# Altium schematic sheet POWER.SchDoc
size A4; SheetNumber: 6; SheetTotal: 6
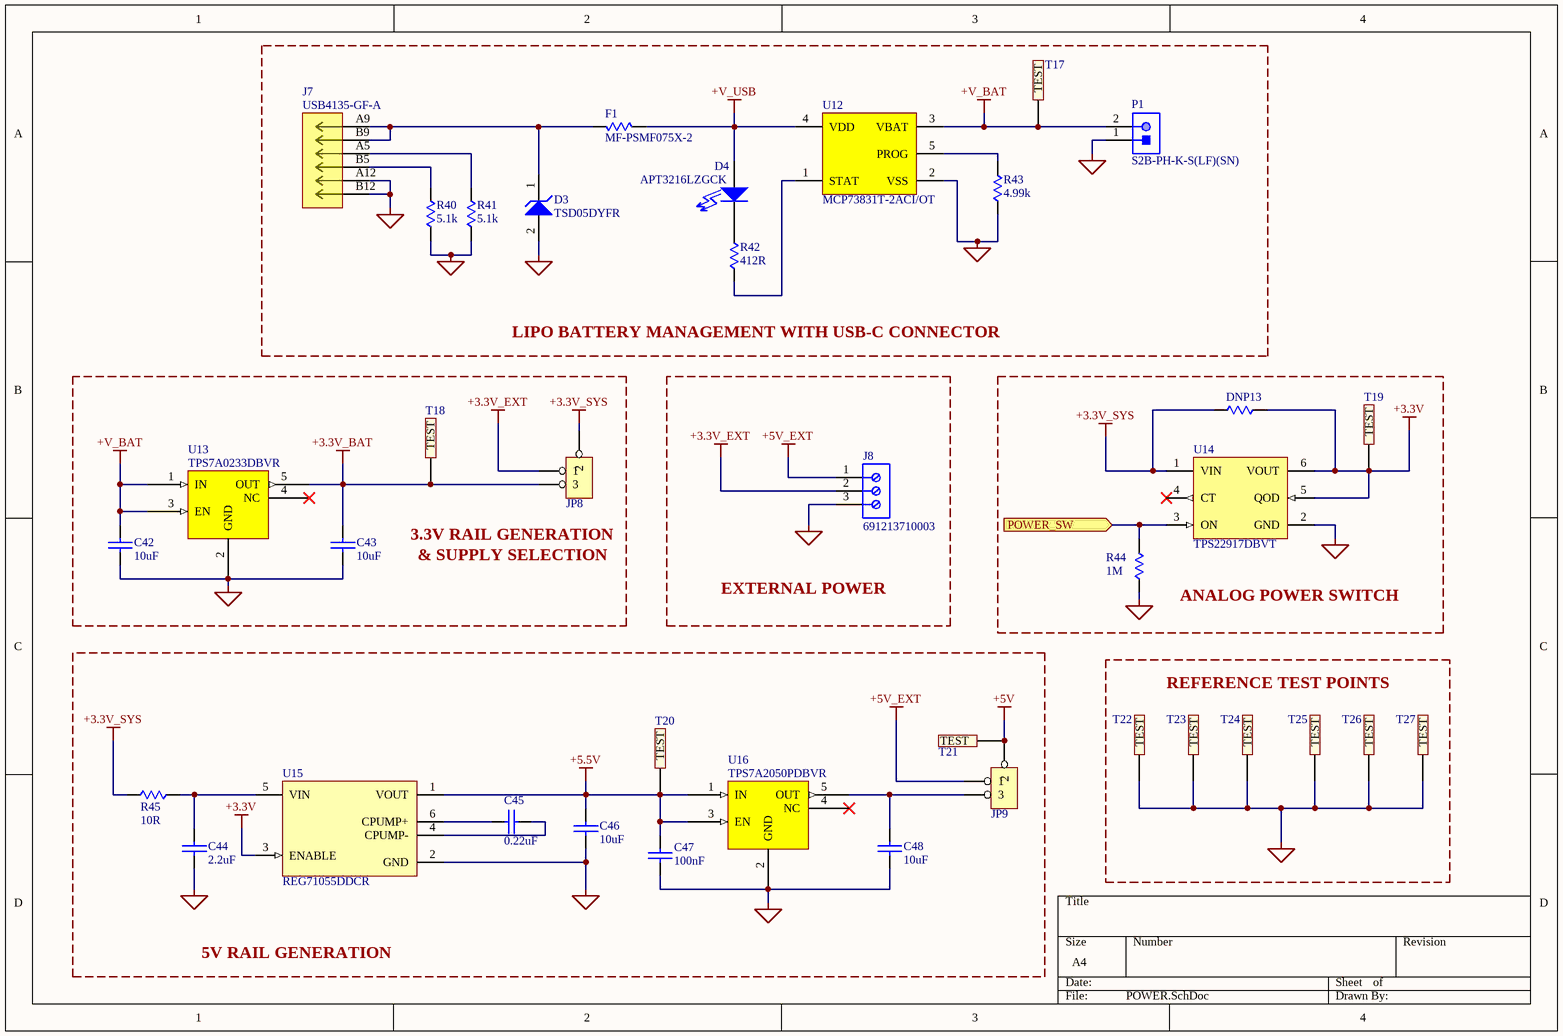
[diagram p0: POWER.SchDoc]

## Parts
C42  10uF  [0603-CAP]
C43  10uF  [0603-CAP]
C44  2.2uF  [0603-CAP]
C45  0.22uF  [0603-CAP]
C46  10uF  [0603-CAP]
C47  100nF  [0603-CAP]
C48  10uF  [0603-CAP]
D3  TSD05DYFR  [TVS_SOD2_DYF_TEX-L]
D4  APT3216LZGCK  [1206-LED]
DNP13  DNP  [0603-RES]  (value not drawn)  (no BOM)
F1  MF-PSMF075X-2  [0805-RES]
J7  USB4135-GF-A  [CONN_USB4135-GF-A_GCT]
J8  691213710003  [691213710003]
JP8  JUMPER1X3  [JUMPER3]  (value not drawn)
JP9  JUMPER1X3  [JUMPER3]  (value not drawn)
P1  S2B-PH-K-S(LF)(SN)  [JST-S2B-PH-K-S_V]
R40  5.1k  [0603-RES]
R41  5.1k  [0603-RES]
R42  412R  [0603-RES]
R43  4.99k  [0603-RES]
R44  1M  [0603-RES]
R45  10R  [0603-RES]
T17  5002K  [TESTPOINT White]  (value not drawn)
T18  5002K  [TESTPOINT White]  (value not drawn)
T19  5002K  [TESTPOINT White]  (value not drawn)
T20  5002K  [TESTPOINT White]  (value not drawn)
T21  5002K  [TESTPOINT White]  (value not drawn)
T22  5011K  [TESTPOINT Black]  (value not drawn)
T23  5011K  [TESTPOINT Black]  (value not drawn)
T24  5011K  [TESTPOINT Black]  (value not drawn)
T25  5011K  [TESTPOINT Black]  (value not drawn)
T26  5011K  [TESTPOINT Black]  (value not drawn)
T27  5011K  [TESTPOINT Black]  (value not drawn)
U12  MCP73831T-2ACI/OT  [SOT23_DBV_TEX-M]
U13  TPS7A0233DBVR  [SOT23_DBV_TEX-M]
U14  TPS22917DBVT  [DBV0006_N]
U15  REG71055DDCR  [DDC0006A_M]
U16  TPS7A2050PDBVR  [SOT23_DBV_TEX-M]

## Blocks framed on the sheet
LIPO BATTERY MANAGEMENT WITH USB-C CONNECTOR: D3 D4 F1 J7 P1 R40-R43 T17 U12
EXTERNAL POWER: J8
ANALOG POWER SWITCH: DNP13 R44 T19 U14
5V RAIL GENERATION: C44-C48 JP9 R45 T20 T21 U15 U16
REFERENCE TEST POINTS: T22-T27

## Ports
POWER_SW (in, see BLOCK DIAGRAM[2B], MCU[1A])

## Nets
+3.3V: DNP13.2 T19.1(TEST) U14.5(QOD) U14.6(VOUT) U15.3(ENABLE)
+3.3V_BAT: C43.1 JP8.3 T18.1(TEST) U13.5(OUT)
+3.3V_EXT: J8.2 JP8.1
+3.3V_SYS: DNP13.1 JP8.2 R45.1 U14.1(VIN)
+5.5V: C46.1 C47.1 T20.1(TEST) U15.1(VOUT) U16.1(IN) U16.3(EN)
+5V: JP9.2 T21.1(TEST)
+5V_EXT: J8.1 JP9.1
+V_BAT: C42.1 P1.2 T17.1(TEST) U12.3(VBAT) U13.1(IN) U13.3(EN)
+V_USB: D4.1 F1.2 U12.4(VDD)
GND: C42.2 C43.2 C44.1 C46.2 C47.2 C48.2 D3.2(A) J7.A12(GND) J7.B12(GND) J8.3 P1.1 R40.2 R41.2 R43.1 R44.1 T22.1(TEST) T23.1(TEST) T24.1(TEST) T25.1(TEST) T26.1(TEST) T27.1(TEST) U12.2(VSS) U13.2(GND) U14.2(GND) U15.2(GND) U16.2(GND)
POWER_SW: R44.2 U14.3(ON) ; port POWER_SW
NetC44_2: C44.2 R45.2 U15.5(VIN)
NetC45_1: C45.1 U15.6(CPUMP+)
NetC45_2: C45.2 U15.4(CPUMP-)
NetC48_1: C48.1 JP9.3 U16.5(OUT)
NetD3_1: D3.1(K) F1.1 J7.A9(VBUS) J7.B9(VBUS)
NetD4_2: D4.2 R42.2
NetJ7_A5: J7.A5(CC1) R41.1
NetJ7_B5: J7.B5(CC2) R40.1
NetR42_1: R42.1 U12.1(STAT)
NetR43_2: R43.2 U12.5(PROG)

Not connected (* = marked no-connect by the designer): U13 4(NC)*; U14 4(CT)*; U16 4(NC)*

## Notes on the sheet
- (near JP8) 3.3V RAIL GENERATION
- & SUPPLY SELECTION

## Library data of the parts
C42 C43 C46 C48 = CGA3E2C0G1H472J080AA: CAP CER 10uF 6.3V X5R 0603; Manufacturer Part Number 1: GRM188R60J106KE47D; Manufacturer 1: Murata Electronics; Detailed Description: CAP CER 100 NF 50V X7R 0603; Tech#: SMT; Supplier 1: DigiKey; Supplier Part Number 1: 490-12538-1-ND; Supplier 2: Mouser; Supplier Part Number 2: 810-CGA3E2C0G1H472J; Price(100): 0.1434; Price(250): 0.10756
C44 = CGA3E2C0G1H472J080AA: CAP CER 2.2UF 35V X5R 0603; Manufacturer Part Number 1: GRM188R6YA225MA12D; Manufacturer 1: Murata Electronics; Tech#: SMT; Detailed Description: CAP CER 2.2UF 35V X5R 0603; Supplier 1: DigiKey; Supplier Part Number 1: 490-10486-1-ND; Supplier 2: Mouser; Supplier Part Number 2: 810-CGA3E2C0G1H472J; Price(100): 0.1434; Price(250): 0.10756
C45 = CGA3E2C0G1H472J080AA: CAP CER 0.22UF 25V X7R 0603; Manufacturer Part Number 1: GRM188R71E224KA88D; Manufacturer 1: Murata Electronics; Tech#: SMT; Detailed Description: CAP CER 0.22UF 25V X7R 0603; Supplier 1: DigiKey; Supplier Part Number 1: 490-3290-1-ND; Supplier 2: Mouser; Supplier Part Number 2: 810-CGA3E2C0G1H472J; Price(100): 0.1434; Price(250): 0.10756
C47 = CGA3E2C0G1H472J080AA: CAP CER 100 NF 50V X7R 0603; Manufacturer Part Number 1: CC0603KRX7R9BB104; Manufacturer 1: YAGEO; Tech#: SMT; Detailed Description: CAP CER 100 NF 50V X7R 0603; Supplier 1: DigiKey; Supplier Part Number 1: 311-1344-1-ND; Supplier 2: Mouser; Supplier Part Number 2: 810-CGA3E2C0G1H472J; Price(100): 0.1434; Price(250): 0.10756
D3 = TSD05DYFR: 5-V 60-A Unidirectional surge protection device 2-SOT -40 to 125; Manufacturer_Name: Texas Instruments; Copyright: Copyright (C) 2026 Ultra Librarian. All rights reserved.; Manufacturer_Part_Number: TSD05DYFR; RefDes: RefDes; Type: Type
D4 = APT3216LZGCK: LED GREEN CLEAR 2SMD; Manufacturer 1: Kingbright; Detailed Description: LED, Green SMT1206 2.65V 2mA 50mcd; Location: #N/A; Tech#: SMT; Spec: 2.65V 2mA 50mcd; Manufacturer Part Number 1: APT3216LZGCK; Supplier 1: DigiKey; Supplier Part Number 1: 754-1944-1-ND; Supplier 2: Mouser; Supplier Part Number 2: 604-APT3216LZGCK; Price(1): 0.94; Price(10): 0.725; Price(25): 0.6076; Price(100): 0.5233; Colour: Green
DNP13 R40 R41 = 4.99K 0603: RES SMD 5.1K OHM 0.1% 1/10W 0603; Manufacturer Part Number 1: RG1608P-512-B-T5; Manufacturer 1: Susumu; Tech#: SMT; Detailed Description: RES SMD 5.1K OHM 0.1% 1/10W 0603; Supplier 1: DigiKey; Supplier Part Number 1: RG16P5.1KBCT-ND; Supplier 2: Mouser; Supplier Part Number 2: 754-RR0816P-4991D68H; Price(100): 0.023
F1 = 240R 0.1%: PTC RESET FUSE 6V 750MA 0805; Manufacturer 1: Bourns; Tech#: SMT; Manufacturer Part Number 1: MF-PSMF075X-2; Detailed Description: PTC RESET FUSE 6V 750MA 0805; Supplier 1: Digikey; Supplier Part Number 1: MF-PSMF075X-2CT-ND; Supplier 2: DigiKey; Supplier Part Number 2: RG20P240BCT-ND; Price(100): 0.149
J7 = USB4135-GF-A: Description; Manufacturer_Name: Global Connector Technology; Copyright: Copyright (C) 2026 Ultra Librarian. All rights reserved.; Manufacturer_Part_Number: USB4135-GF-A; RefDes: RefDes; Type: Type
J8 = CMP-1502-02527-3: 213 Series 5MM Pitch Straight, Pcb Terminal Block, Through Hole, 3 Way; Stripping Length: -7mm; Wire Gauge (Max): 26AWG; Pitch: 5.0038mm; Voltage: 300V; Current: 10A; Wire/Cable Gauge: 16AWG; Connector Type: PCB, Terminal Block; Plating: Brass, Steel; Number of Positions Per Level: 3; Number of Levels: 1; Height: 10mm; Housing Material: Nylon; Termination: Screw; RoHS: Compliant; Max Operating Temperature: 105°C; Contact Plating: Tin; Contact Material: Brass; Number of Pins: 3; Color: Green; Length: 8.3mm; REACH SVHC: Unknown; Packaging: Box; Wire Gauge (Min): 16AWG; Min Operating Temperature: -40°C; Lead Pitch: 5mm; Number of Contacts: 3; Width: 15.6mm; Mount: Through Hole
JP8 JP9 = 68001-203HLF: CONN HEADER VERT 36POS 2.54MM; Manufacturer 1: FCI; Detailed Description: Jumper, 1x3 Vertical T/H 0.1in; Location: #N/A; Notes: Can be 68001-236HLF cut to length; Tech#: T/H; Manufacturer Part Number 1: 68001-203HLF; Supplier 1: DigiKey; Supplier Part Number 1: 609-3470-ND; Supplier 2: Mouser; Supplier Part Number 2: 649-68001-203HLF; Price(1): 0.43; Price(10): 0.32; Price(25): 0.32; Price(100): 0.2436
P1 = CMP-1755-00004-1: Male Header, Pitch 2 mm, 1 x 2 Position, Height 4.8 mm, Tail Length 3.4 mm, -25 to 85 degC, RoHS, Bulk; Case\Package: Radial; Tolerance: 20%; Capacitance: 10 uF; Voltage Rating (DC): 50 V; Packaging: Bulk; ComponentLink1URL: http://www.jst-mfg.com/product/pdf/eng/ePH.pdf; Radiation Hardening: No; Height: 11 mm; Package Quantity: 200; PackageDescription: Male Header, Pitch 2 mm, 1 x 2 Position, Height 4.8 mm, Tail Length 3.4 mm; PackageReference: S2B-PH-K-S; Diameter: 5 mm; Pins: 2; Mount: Through Hole; Max Operating Temperature: 85 degC; Min Operating Temperature: -40 degC; ComponentLink1Description: Datasheet; DatasheetVersion: Dec-12; Length: 11 mm; Lead Pitch: 2 mm; REACH SVHC: No SVHC; Voltage Rating: 50 V; RoHSCompliant: true
R42 = 4.99K 0603: RES SMD 412OHM 0.1% 1/10W 0603; Manufacturer Part Number 1: RT0603BRD07412RL; Manufacturer 1: YAGEO; Tech#: SMT; Detailed Description: RES SMD 412OHM 0.1% 1/10W 0603; Supplier 1: DigiKey; Supplier Part Number 1: YAG1659CT-ND; Supplier 2: Mouser; Supplier Part Number 2: 754-RR0816P-4991D68H; Price(100): 0.023
R43 = 4.99K 0603: RES SMD 4.99KOHM 0.1% 1/10W 0603; Manufacturer Part Number 1: RG1608P-4991-B-T5; Manufacturer 1: Susumu; Tech#: SMT; Detailed Description: RES SMD 4.99KOHM 0.1% 1/10W 0603; Supplier 1: DigiKey; Supplier Part Number 1: RG16P4.99KBCT-ND; Supplier 2: Mouser; Supplier Part Number 2: 754-RR0816P-4991D68H; Price(100): 0.023
R44 = 4.99K 0603: RES SMD 1MOHM 0.1% 1/10W 0603; Manufacturer Part Number 1: RT0603BRD071ML; Manufacturer 1: YAGEO; Detailed Description: RES SMD 1OHM 0.1% 1/10W 0603; Tech#: SMT; Supplier 1: DigiKey; Supplier Part Number 1: YAG4498CT-ND; Supplier 2: Mouser; Supplier Part Number 2: 754-RR0816P-4991D68H; Price(100): 0.023
R45 = 4.99K 0603: RES SMD 10OHM 0.05% 1/10W 0603; Manufacturer Part Number 1: RNCF0603AKT10R0; Manufacturer 1: Stackpole Electronics; Tech#: SMT; Detailed Description: RES SMD 10OHM 0.05% 1/10W 0603; Supplier 1: DigiKey; Supplier Part Number 1: RNCF0603AKT10R0CT-ND; Supplier 2: Mouser; Supplier Part Number 2: 754-RR0816P-4991D68H; Price(100): 0.023
T17-T21 = 5002K: PC TEST POINT MINIATURE WHITE; Manufacturer 1: Keystone Electronics; Detailed Description: Connector, TestPoint White; Location: F1-33; Tech#: T/H; Manufacturer Part Number 1: 5002K; Supplier 1: DigiKey; Supplier Part Number 1: 36-5002-ND; Supplier 2: Mouser; Supplier Part Number 2: 534-5002; Price(1): 0.56; Price(10): 0.506; Price(100): 0.3541
T22-T27 = 5011K: PC TEST POINT MULTIPURPOSE BLACK; Manufacturer 1: Keystone Electronics; Detailed Description: Connector, TestPoint Black; Location: F1-34; Tech#: T/H; Manufacturer Part Number 1: 5011K; Supplier 1: DigiKey; Supplier Part Number 1: 36-5011-ND; Supplier 2: Mouser; Supplier Part Number 2: 534-5011; Price(1): 0.57; Price(10): 0.506; Price(100): 0.3541
U12 = CMP-0133-00143-2: IC CONTROLLR LI-ION 4.2V SOT23-5; Max Power Dissipation: 1.54W; Output Current: 500mA; Max Output Voltage: 4.5V; Number of Outputs: 1; Min Output Voltage: 4.168V; Min Supply Voltage: 3.75V; Max Input Voltage: 6V; Voltage Rating: 4.534V; Drain to Source Resistance: 350mR; Max Operating Temperature: 85°C; Length: 0.122inch; Number of Pins: 5; REACH SVHC: No SVHC; Radiation Hardening: No; Min Operating Temperature: -40°C; Weight: 0.00709oz; Contact Plating: Tin; Termination: SMD/SMT; Case/Package: SOT-23; Mount: Surface Mount; Width: 0.071inch; Packaging: Tape and Reel; Number of Cells: 1; Max Charge Current: 500mA; Height: 0.051inch; Number of Channels: 1; Output Voltage: 4.2V; Max Supply Voltage: 6V; Lead Free: Lead Free
U13 U16 = TPS7A0230PDBVR: 200mA, nanopower-IQ (25 nA), low-dropout (LDO) voltage regulator with enable 5-SOT-23 -40 to 125; Manufacturer_Name: Texas Instruments; Copyright: Copyright (C) 2026 Ultra Librarian. All rights reserved.; Manufacturer_Part_Number: TPS7A0230PDBVR; RefDes: RefDes; Type: Type
U14 = TPS22917DBVT: 5.5-V, 2-A, 80-mÎ© , 10-nA leakage load switch adj. rise time and adj output discharge 6-SOT-23 -40 to 125; Manufacturer_Name: Texas Instruments; TYPE: TYPE; RefDes: RefDes; Copyright: Copyright (C) 2026 Ultra Librarian. All rights reserved.; Manufacturer_Part_Number: TPS22917DBVT
U15 = CMP-0391-00039-2: 5.5 V, Buck / Boost Charge Pump, 60 mA, 3 to 5.5 V Input with 2-Cell Alkaline / Nixx Input, -40 to 85 degC, 6-pin SOT23 (DDC6), Green (RoHS & no Sb/Br); Manufacturer: Texas Instruments; Vin(Max)(V): 5.5; Iq(Typ)(mA): 0.065; Efficiency(Typ)(%): 90; Vin(Min)(V): 3; Vout(Min)(V): 5.2; Vout(Max)(V): 5.8; Switching Frequency(Max)(kHz): 1000; Iout(Max)(A): 0.06; 2-Cell Alkaline/Nixx Input: TRUE; Preset Vout(V): 5.5; PartNumber: REG71055DDCR; ComponentLink2URL: http://www.ti.com/general/docs/lit/getliterature.tsp?genericPartNumber=REG71055&fileType=pdf; Code_JEDEC: MO-193; ComponentLink3Description: Package Specification; Eco-Plan: Green (RoHS & no Sb/Br); PackageVersion: 4204403-3/E; Topology: Buck/Boost; ComponentLink1URL: http://www.ti.com/; PackageReference: DDC0006A; PackageDescription: 6-Pin Plastic Small Outline, Body 2.9 x 1.6 mm, 0.95 mm Pitch; ComponentLink3URL: http://www.ti.com/litv/pdf/mpds124d; Mounting Technology: Surface Mount; ComponentLink2Description: Datasheet; DatasheetVersion: SBAS221G; ComponentLink1Description: Manufacturer URL